# EAGLE design Adafruit Trinket 3V microUSB (EAGLE 6.6.0)
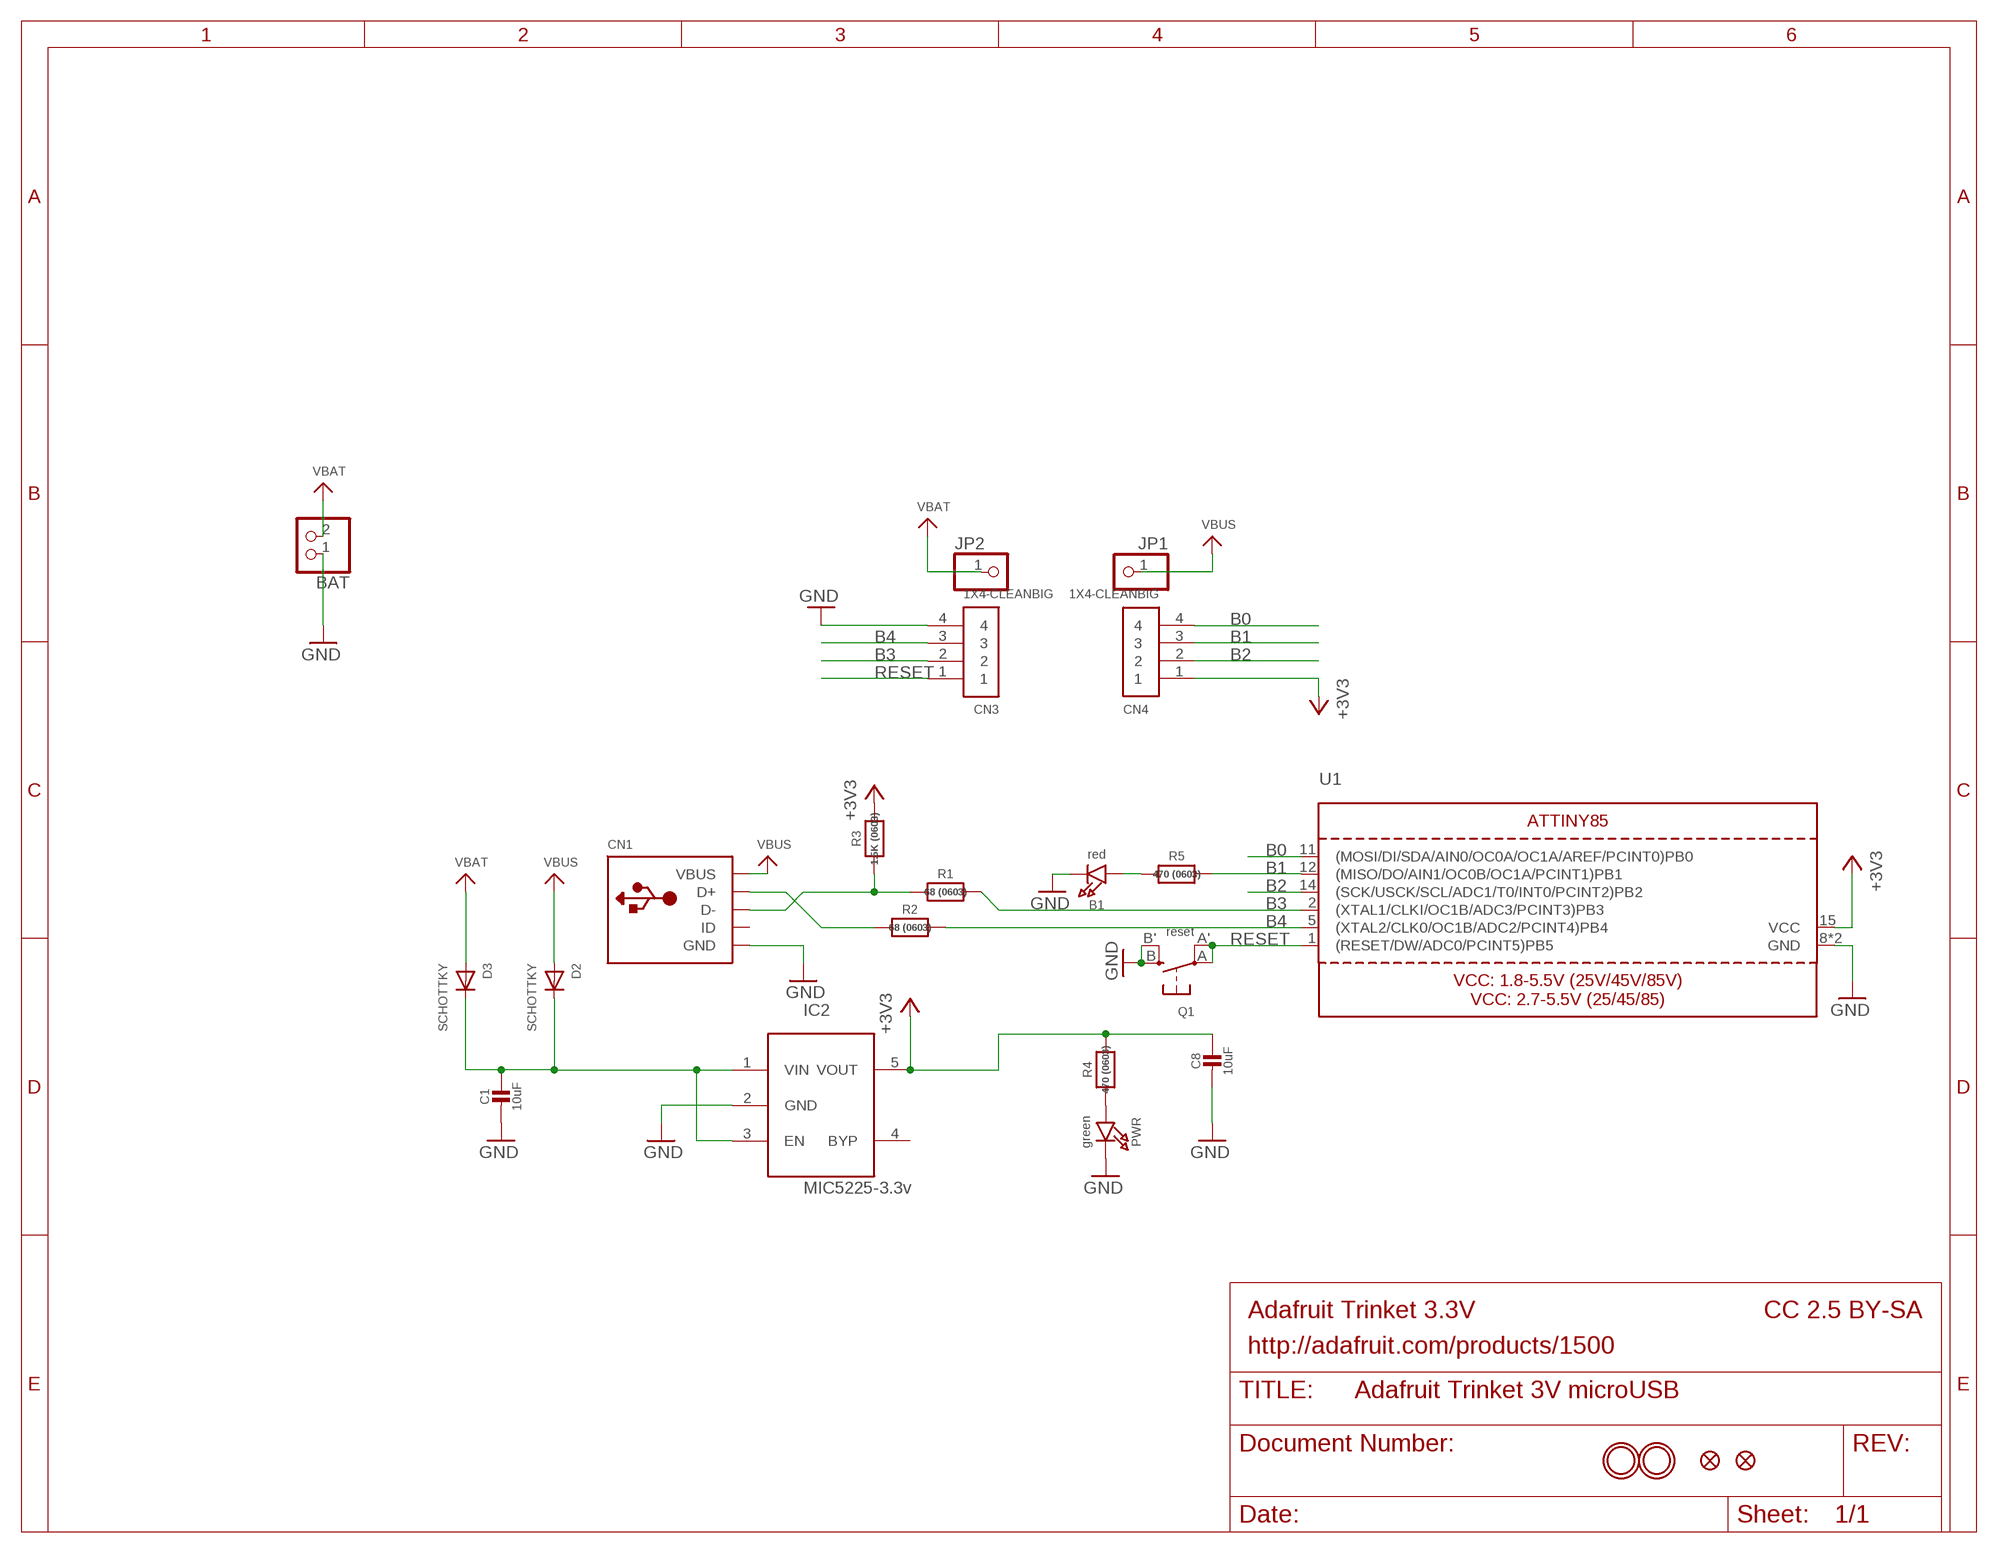
[diagram p0: schematic, sheet 1]

## Parts
B1  red  LED0805_NOOUTLINE  [CHIPLED_0805_NOOUTLINE]
BAT  CON_JST_PH_2PIN  [JSTPH2]
C1  10uF  CAP_CERAMIC0805-NOOUTLINE  [0805-NO]
C8  10uF  CAP_CERAMIC0805-NOOUTLINE  [0805-NO]
CN1  USBMICRO_20329  [4UCONN_20329]
CN3  1X4-CLEANBIG  [1X04-CLEANBIG]
CN4  1X4-CLEANBIG  [1X04-CLEANBIG]
D2  SCHOTTKY  DIODE_SOD-123FL  [SOD-123FL]
D3  SCHOTTKY  DIODE_SOD-123FL  [SOD-123FL]
IC2  MIC5225-3.3v  LP298XS  [SOT23-5L]
JP1  PINHD-1X1CB  [1X01-CLEANBIG]
JP2  PINHD-1X1CB  [1X01-CLEANBIG]
PWR  green  LED0805_NOOUTLINE  [CHIPLED_0805_NOOUTLINE]
Q1  reset  SWITCH_TACT_SMT4.6X2.8  [BTN_KMR2_4.6X2.8]
R1  68 (0603)  RESISTOR_0603_NOOUT  [0603-NO]
R2  68 (0603)  RESISTOR_0603_NOOUT  [0603-NO]
R3  1.5K (0603)  RESISTOR_0603_NOOUT  [0603-NO]
R4  470 (0603)  RESISTOR_0603_NOOUT  [0603-NO]
R5  470 (0603)  RESISTOR_0603_NOOUT  [0603-NO]
U1  ATTINY85  [MLF20_4X4MM_0.5MM_ATMEL]
U$1  FIDUCIAL""  [FIDUCIAL_1MM]
U$6  FIDUCIAL""  [FIDUCIAL_1MM]
U$8  MOUNTINGHOLE2.0  [MOUNTINGHOLE_2.0_PLATED]
U$9  MOUNTINGHOLE2.0  [MOUNTINGHOLE_2.0_PLATED]

## Nets
+3V3: C8.1 CN4.1 IC2.5(VOUT) R3.2 R4.2 U1.15(VCC)
B0: CN4.4 U1.11((MOSI/DI/SDA/AIN0/OC0A/OC1A/AREF/PCINT0)PB0)
B1: CN4.3 R5.2 U1.12((MISO/DO/AIN1/OC0B/OC1A/PCINT1)PB1)
B2: CN4.2 U1.14((SCK/USCK/SCL/ADC1/T0/INT0/PCINT2)PB2)
B3: CN3.2 R1.2 U1.2((XTAL1/CLKI/OC1B/ADC3/PCINT3)PB3)
B4: CN3.3 R2.2 U1.5((XTAL2/CLK0/OC1B/ADC2/PCINT4)PB4)
D+: CN1.D+ R2.1
D-: CN1.D- R1.1 R3.1
GND: B1.C BAT.1 C1.2 C8.2 CN1.BASE@1(GND) CN1.BASE@2(GND) CN1.GND CN1.SPRT@1(GND) CN1.SPRT@2(GND) CN1.SPRT@3(GND) CN1.SPRT@4(GND) CN3.4 IC2.2(GND) PWR.C Q1.B'(S1) Q1.B(S) U1.8(GND) U1.THERMAL(GND)
N$1: B1.A R5.1
N$6: PWR.A R4.1
N$7: C1.1 D2.C D3.C IC2.1(VIN) IC2.3(EN)
RESET: CN3.1 Q1.A'(P1) Q1.A(P) U1.1((RESET/DW/ADC0/PCINT5)PB5)
VBAT: BAT.2 D3.A JP2.1
VBUS: CN1.VBUS D2.A JP1.1
Unconnected: CN1.ID IC2.4(BYP)

## Notes on the sheet
- Adafruit Trinket 3.3V | CC 2.5 BY-SA
- http://adafruit.com/products/1500

## Library data of the parts
B1 PWR = microbuilder:LED: LED 0603 - 0603 Surface Mount Package 2mA: Green LED - Low Power (3.9mcd, 2ma, 1.7Vf) - Digikey: 475-2709-2-ND Orange LED - Low Power (9.8mcd, 2ma, 1.8Vf) - Digikey: 475-1194-2-ND Red LED - Low Power (5mcd, 2ma, 1.8Vf) - Digikey: 475-1195-2-ND Yellow LED - Low Power (7mcd, 2ma, 1.8Vf) - Digikey: 475-1196-2-ND 5mA: Blue LED - Low Power (17mcd, 5ma, 2.9Vf) - Digikey: LNJ937W8CRACT-ND 0805 - 0805 Surface Mount Package 2mA: Red LED (8.8mcd, 2mA, 1.8Vf, Clear) - Low Power [Digikey: 475-2510-1-ND] Green LED (5mcd, 2mA, 1.8Vf, Clear) - Low Power [Digikey: 475-2730-1-ND] Yellow LED (11.3mcd, 2mA, 1.8Vf, Clear) - Low Power [Digikey: 475-2555-1-ND] 20mA: Red LED (104mcd, 20mA, Diffused) - LS R976 [Digikey: 475-1278-6-ND] Red LED (12mcd, 20mA, 2.0Vf, Clear) - APT2012EC [Digikey: 754-1128-1-ND] Green LED (15mcd, 20mA, 2.2Vf, Clear) - APT2012GC [Digikey: 754-1131-1-ND] Orange LED (160mcd, 20mA, 2.1Vf, Clear) - APT2012SECK [Digikey: 754-1130-1-ND] 1206 - 1206 Surface Mount Package Green LED (26mcd, 20mA, Diffused) - LG N971 [Digikey: 475-1407-6-ND] Red LED (15mcd, 20mA, Diffused) - LH N974 [Digikey: 475-1416-6-ND] Cree - Cree High-Power Surface Mount LEDs XPEBWT-L1-0000-00D50 - White 111lm 350mA 2.9Vf 6200K 110° XTEAWT-00-0000-00000LEE3 - White 114lm 350mA 2.85Vf 5000K 115° Everlight - Everlight 45-21 Series Surface Mount LEDs 45-21/QK2C-B2832AC2CB2/2T - Warm White 2000mcd 20mA 3.25Vf 3050K 120° 45-21/LK2C-B38452C4CB2/2T - Nuetral White 2000mcd 20mA 3.25Vf 4150K 120° 45-21/LK2C-B50634C6CB2/2T - Cold White 2200mcd 20mA 3.25Vf 5650K 120° PLCC2 Reverse Mount LS T77K-J1L2-1-0-2-R18-Z - Red 11.25mcd 2mA 1.8Vf 630nm 120° LO T77K-L1M2-24-Z - Orange 19.6mcd 2mA 1.8Vf 606nm 120° LY T77K-K2M1-26-Z - Yellow 15.7mcd 2mA 1.8Vf 587nm 120°
BAT = microbuilder:CON_JST_PH_2PIN: JST 2-Pin Right-Angle Connector PH-Series - 4UConnector: 17311 SH-Series - 4UConnector: 07278
C1 C8 = microbuilder:CAP_CERAMIC: Ceramic Capacitors For new designs, use the packages preceded by an '_' character since they are more reliable: The following footprints should be used on most boards: _0402 - Standard footprint for regular board layouts _0603 - Standard footprint for regular board layouts _0805 - Standard footprint for regular board layouts _1206 - Standard footprint for regular board layouts For extremely tight-pitch boards where space is at a premium, the following 'micro-pitch' footprints can be used (smaller pads, no silkscreen outline, etc.): _0402MP - Micro-pitch footprint for very dense/compact boards _0603MP - Micro-pitch footprint for very dense/compact boards _0805MP - Micro-pitch footprint for very dense/compact boards _1206MP - Micro-pitch footprint for very dense/compact boards
CN1 = microbuilder:USB: USB Connectors USBMINIB - Surface Mount Female Mini-B USB Connector 4UConnector: 06564
CN3 CN4 = adafruit:1X4: 4-pin connector
D2 D3 = adafruit:DIODE: Diode SMADIODE - SMA Surface Mount Package 20V 1A Schottky Diode Digikey: 641-1014-6-ND DO-1N4148 - Through Hole Small Current Diode SOD-123 20V 1 A (.5mV Vf) Schottky Diode - Digikey: MBRX120TPMSCT-ND SOD-323 10V 570mA (.38mV Vf, 3ns) Schottky Diode - Digikey: ZLLS410CT-ND SOD-523 30V 30mA Schottky Diode (RB751S-40TE61) - Digikey: RB751S-40TE61CT-ND SOT23-R/W - SOT23 Package (R = Solder Paste/Reflow Ovens, W = Hand-Soldering) BAT54Film 40V 300mA - Digikey: 497-7162-1-ND
IC2 = adafruit:LP298X
JP1 JP2 = adafruit:PINHD-1X1: Pin header 1x1 for 0.1" spacing With round pins
Q1 = microbuilder:SWITCH_TACT_SMT: SMT Tact Switches 6x6mm - Digikey: P12940SCT-ND KMR2 (4.6x2.8mm) - Digikey: 401-1426-1-ND EVQ-PQHB55 - Light Touch, 160GF (4.5x4.5mm) - Digikey: P8090SCT-ND KMT0 - KMT021 NGJ LHS (etc.) IP68/Waterproof - Digikey: CKN10289CT-ND
R1-R5 = microbuilder:RESISTOR: Resistors For new designs, use the packages preceded by an '_' character since they are more reliable: The following footprints should be used on most boards: _0402 - Standard footprint for regular board layouts _0603 - Standard footprint for regular board layouts _0805 - Standard footprint for regular board layouts _1206 - Standard footprint for regular board layouts For extremely tight-pitch boards where space is at a premium, the following 'micro-pitch' footprints can be used (smaller pads, no silkscreen outline, etc.): _0402MP - Micro-pitch footprint for very dense/compact boards _0603MP - Micro-pitch footprint for very dense/compact boards _0805MP - Micro-pitch footprint for very dense/compact boards _1206MP - Micro-pitch footprint for very dense/compact boards
U1 = microbuilder:ATTINY85: ATTINT85
U$1 U$6 = microbuilder:FIDUCIAL: Fiducial Alignment Points Various fiducial points for machine vision alignment.; BOM: EXCLUDE
U$8 U$9 = microbuilder:MOUNTINGHOLE: Mounting Hole For #2 screws (0.086"/2.18mm width, 0.094"/2.4mm hole) use 2.5mm; BOM: EXCLUDE

## Net classes
1 power: width 0.305 mm

## Board
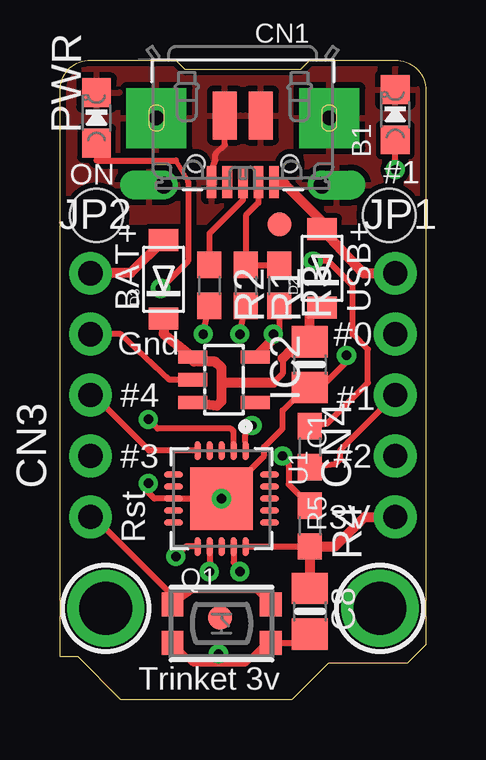
[diagram p1: board, top side]
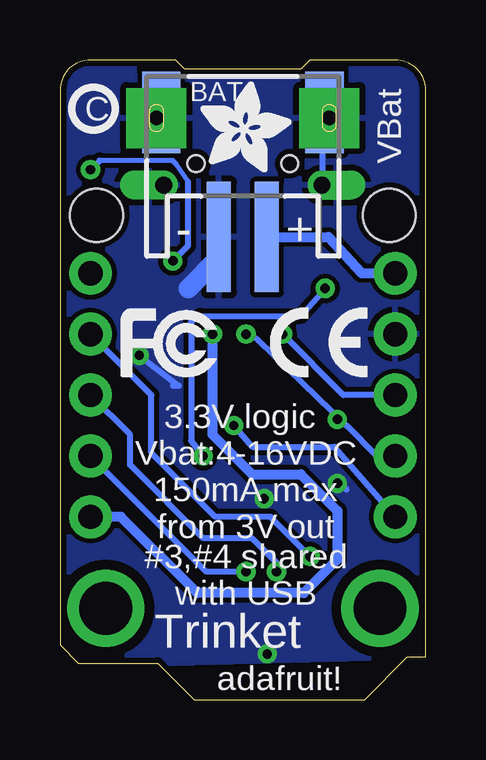
[diagram p2: board, bottom side, seen from below]

Size 15.24 x 26.67 mm. Coordinates in mm from the lower left corner, seen from the top.
Outline: 15.24,25.4 15.24,2.29 14.48,1.52 11.18,1.52 9.65,0 2.54,0 0.76,1.78 0,1.78 0,25.4 arc-90 1.27,26.67 4.83,26.67 5.21,26.29 10.03,26.29 10.41,26.67 13.97,26.67 arc-90 15.24,25.4
Copper layers (1*16): Top 0.035mm / dielectric 1.5mm / Bottom 0.035mm
Design rules "adafruit": minimum track width 8mil, minimum drill 15.5mil, track to track 8mil, track to pad 8mil, pad to pad 8mil, via to via 8mil, smd to smd 8mil, copper to edge 10mil, drill to drill 8mil, minimum pad ring 10mil, minimum via ring 8mil, stop-mask expansion 2mil, vias tented up to drill 20mil, thermal gap 10mil
Holes 2.2 mm at 1.52,20.19 13.72,20.19

### Footprints (pad centres in the part's own frame; a part is rotated, then mirrored left to right if it is on the bottom)
CHIPLED_0805_NOOUTLINE = smd 1.2 x 1.2: A 0,-1.05; C 0,1.05
JSTPH2 = smd 1 x 4.6: 1 -1,-3.7; 2 1,-3.7 | smd 1.6 x 3.4: NC1 -3.4,1.5; NC2 3.4,1.5
0805-NO = smd 1.3 x 1.5: 1 -0.95,0; 2 0.95,0
4UCONN_20329 = smd 1 x 2: BASE@1 -0.75,-2; BASE@2 0.75,-2 | smd 0.4 x 1.35: D+ 0,0.775; D- -0.65,0.775; GND 1.3,0.775; ID 0.65,0.775; VBUS -1.3,0.775 | drill 0.7 offset: SPRT@1 -3.3,0.9; SPRT@2 3.3,0.9 | drill 0.6 pad 2.5 square: SPRT@3 -3.6,-1.9; SPRT@4 3.6,-1.9 | hole 0.7: -1.95,0; 1.95,0
1X04-CLEANBIG = drill 1.016 pad 1.778: 1 -3.81,0; 2 -1.27,0; 3 1.27,0; 4 3.81,0
SOD-123FL = smd 0.91 x 1.22: A 1.637,0; C -1.637,0
SOT23-5L = smd 0.55 x 1.2: 1 -0.95,-1.3; 2 0,-1.3; 3 0.95,-1.3; 4 0.95,1.3; 5 -0.95,1.3
1X01-CLEANBIG = drill 1.016 pad 1.778: 1 0,0
BTN_KMR2_4.6X2.8 = smd 0.9 x 1: A 2.05,0.8; A' -2.05,0.8; B 2.05,-0.8; B' -2.05,-0.8
0603-NO = smd 1.1 x 1: 1 -0.85,0; 2 0.85,0
MLF20_4X4MM_0.5MM_ATMEL = smd 0.8 x 0.25: 1 -2,1; 2 -2,0.5; 3 -2,0; 4 -2,-0.5; 5 -2,-1; 11 2,-1; 12 2,-0.5; 13 2,0; 14 2,0.5; 15 2,1 | smd 0.25 x 0.8: 6 -1,-2; 7 -0.5,-2; 8 0,-2; 9 0.5,-2; 10 1,-2; 16 1,2; 17 0.5,2; 18 0,2; 19 -0.5,2; 20 -1,2 | smd 2.6 x 2.6: THERMAL 0,0
FIDUCIAL_1MM = smd 1 x 1: 1 0,0
MOUNTINGHOLE_2.0_PLATED = drill 2.2 pad 3: P$1 0,0

### Placement (x,y rotation side)
B1  13.97,24.38 0 top
BAT  7.62,22.99 0 bottom
C1  10.41,13.97 270 top
C8  10.41,3.68 270 top
CN1  7.62,22.35 180 top
CN3  1.27,11.43 90 top
CN4  13.97,11.43 90 top
D2  10.92,17.98 90 top
D3  4.32,17.53 90 top
IC2  6.83,13.34 270 top
JP1  13.97,17.78 0 top
JP2  1.27,17.78 0 top
PWR  1.52,24.26 0 top
Q1  6.73,3.18 0 top
R1  7.75,17.27 270 top
R2  6.22,17.27 270 top
R3  9.14,17.27 270 top
R4  10.41,7.24 270 top
R5  10.41,10.54 270 top
U1  6.73,8.38 270 top
U$1  9.14,19.81 0 top
U$5  [ADAFRUIT_3.5MM]  9.4,21.97 0 bottom
U$6  6.67,3.43 0 top
U$8  1.91,3.81 0 top
U$9  13.34,3.81 0 top
U$12  [PCBFEAT-REV-040]  13.84,24.64 0 bottom
U$13  [SYMBOL_FCC_TINY]  12.7,13.46 0 bottom
U$14  [SYMBOL_CE_TINY]  6.48,13.46 0 bottom

### Tracks (layer width: path | path; a pad name or v marks a point on that pad's centre or on a via)
+3V3  (via drill 0.39)
  Top 0.254: U1.15 R4.2 | R3.2 9.14,15.24 | 9.14,15.24 9.02,15.17 | 9.14,15.24 v8.89,15.24
  Top 0.406: C8.1 R4.2 11.47,6.39 12.7,7.62 CN4.1 | 9.02,15.17 IC2.5
  Bottom 0.406: v8.89,15.24 8.89,11.05 7.24,9.4 5.21,9.4 3.68,7.87 3.68,5.84 5.08,4.45 9.53,4.45 12.7,7.62 CN4.1
B0  (via drill 0.39)
  Top 0.254: U1.11 5.24,6.38 v4.83,5.97
  Bottom 0.254: v4.83,5.97 6.48,7.62 8.76,7.62 11.43,10.29 11.43,12.7 CN4.4
B1  (via drill 0.39)
  Top 0.254: U1.12 6.23,5.34 v6.22,5.33 | R5.2 11.47,9.82 11.68,10.03 11.68,10.41 CN4.3
  Bottom 0.254: v6.22,5.33 6.22,5.71 7.24,6.73 9.27,6.73 12.32,9.78 12.32,11.05 CN4.3
B2  (via drill 0.39)
  Top 0.254: U1.14 7.23,5.72 v7.49,5.33
  Bottom 0.254: v7.49,5.33 9.14,5.33 CN4.2
B3  (via drill 0.39)
  Top 0.254: v7.49,15.24 R1.2 | U1.2 7.23,11.18 7.11,11.3 4.06,11.3 v3.68,11.68
  Bottom 0.254: CN3.2 2.03,10.16 3.3,11.43 | 3.3,11.43 6.99,14.99 7.37,15.24 v7.49,15.24 | v3.68,11.68 3.3,11.43
B4  (via drill 0.39)
  Top 0.254: v5.97,15.24 R2.2 | U1.5 3.72,10.38 1.4,12.7 CN3.3
  Bottom 0.254: CN3.3 3.43,12.7 v5.97,15.24
D+
  Top 0.254: CN1.D+ 7.62,20.83 6.22,19.43 R2.1
D-
  Top 0.254: 7.89,18.25 R1.1 | R1.1 R3.1 | CN1.D- 8.27,20.72 7.75,20.19 R1.1 | 7.87,18.41 7.75,18.03 R1.1
GND  (via drill 0.39)
  Top 0.254: Q1.B' 5.53,1.52 6.48,1.52 | 6.48,1.52 7.75,1.52 8.6,2.38 Q1.B 10.06,2.38 C8.2 | IC2.2 4.57,13.34 2.54,15.24 CN3.4 | 6.48,1.52 v6.6,1.91 | C1.2 10.35,13.08 11.05,13.21 11.94,14.1 v11.94,14.35 | v3.68,9.02 3.68,8.64 3.94,8.38 U1.8 U1.THERMAL 8.51,10.16 8.51,10.54 9.27,11.3 9.27,12.07 10.16,12.95 10.41,12.95 | CN1.GND 6.32,22.07 6.48,22.48 6.48,22.73 6.87,23.13 CN1.BASE@2
  Bottom 0.254: v11.94,14.35 10.29,13.08 10.54,13.08 | v3.68,9.02 3.56,9.02 3.3,8.76 | CN1.SPRT@4 4.32,23.95 CN1.SPRT@2
  Bottom 0.813: BAT.1 8.62,18.43 9.91,17.14
  other vias: 6.73,8.38
  pour Bottom: -0.25,26.8 0,1.78 15.24,1.4 14.99,26.42
  pour Top: 0.25,26.8 0.25,19.94 15.11,19.94 15.11,26.8
N$1  (via drill 0.39)
  Top 0.254: R5.1 11.14,11.52 12.83,13.21 12.83,14.61 12.19,15.24 12.19,17.27 11.18,18.29 v10.54,18.29 | v13.97,22.1 B1.A
  Bottom 0.203: 9.91,21.59 10.41,22.35 10.54,22.48 13.59,22.48
  Bottom 0.254: v10.54,18.29 9.91,18.92 9.91,21.59 | 13.59,22.48 v13.97,22.1
N$6  (via drill 0.39)
  Top 0.203: 4.83,22.48 5.33,21.59
  Top 0.254: v9.27,10.16 9.53,9.78 9.53,8.98 R4.1 | PWR.A 1.52,22.48 4.83,22.48 | 5.33,21.59 5.33,18.29 v4.19,17.14
  Bottom 0.254: v9.27,10.16 9.78,10.8 9.78,15.75 9.4,16 5.21,16 v4.19,17.14
N$7
  Top 0.254: 5.59,14.1 IC2.1 | 9.27,14.22 9.27,13.59 8.89,13.21
  Top 0.406: D3.C 4.32,15.25 IC2.1 | IC2.3 6.54,12.26 6.73,12.45 6.73,13.21 | 6.73,13.21 6.73,13.84 6.48,14.1 5.59,14.1 | D2.C 10.41,15.96 C1.1 9.97,14.48 9.53,14.48 9.27,14.22 | 8.89,13.21 6.73,13.21
RESET  (via drill 0.39)
  Top 0.254: Q1.A 8.18,4.57 5.53,4.57 Q1.A' 4.57,4.08 4.57,4.45 1.4,7.62 CN3.1 | U1.1 7.71,11.02 v8,11.43
  Bottom 0.254: v8,11.43 7.24,10.54 3.81,10.54 CN3.1
VBAT
  Top 0.406: D3.A 2.93,17.78 JP2.1
  Bottom 0.254: 1.4,17.91 JP2.1
  Bottom 0.406: BAT.2 4.05,19.29 2.67,17.78 JP2.1
VBUS
  Top 0.254: CN1.VBUS 8.92,21.5
  Top 0.406: JP1.1 12.64,17.78 D2.A 10.92,19.94 9.37,21.5 8.92,21.5

### Text on the board
tPlace: #1 | ON | BAT+ | USB+ | Gnd | #0 | #4 | #1 | #3 | #2 | Rst | 3V | Trinket 3v
bPlace: VBat | + | - | 3.3V logic | Vbat:4-16VDC / 150mA max / from 3V out | #3,#4 shared / with USB | Trinket | adafruit!